# EAGLE schematic untitled (EAGLE 7.6.0)
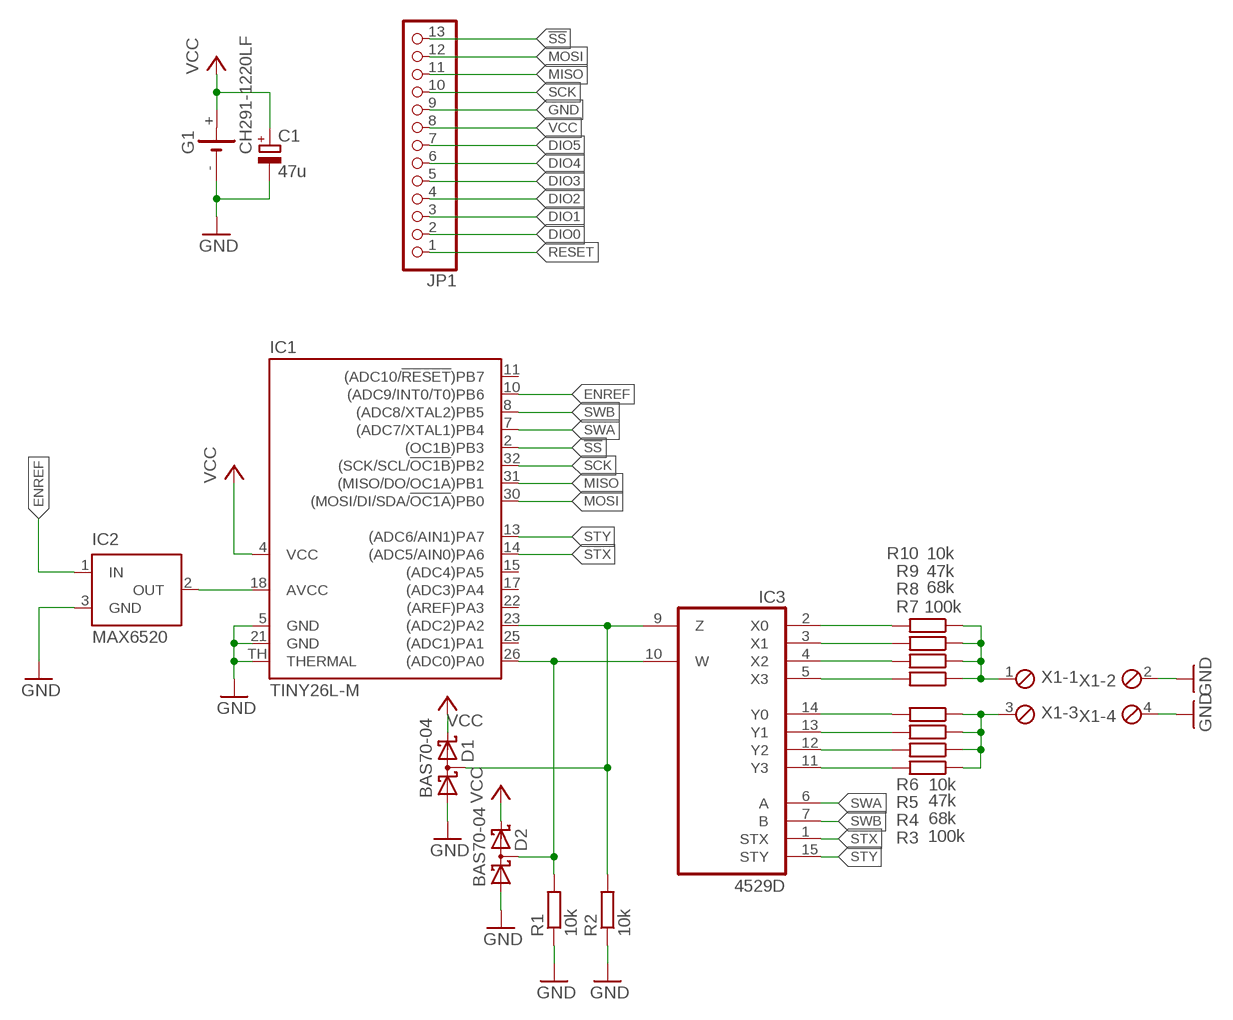
[diagram p0: schematic, sheet 1]

## Parts
C1  47u  CPOL-EUSANYO_SMD_E7  [SANYO-OSCON_SMD_E7]
D1  BAS70-04  [SOT23]
D2  BAS70-04  [SOT23]
G1  CH291-1220LF  [CH291-1220LF]
IC1  TINY26L-M  [MLF32-TH]
IC2  MAX6520  [SOT23]
IC3  4529D  [SO16]
JP1  PINHD-1X13  [1X13]
R1  10k  R-EU_R1206  [R1206]
R2  10k  R-EU_R1206  [R1206]
R3  100k  R-EU_R1206  [R1206]
R4  68k  R-EU_R1206  [R1206]
R5  47k  R-EU_R1206  [R1206]
R6  10k  R-EU_R1206  [R1206]
R7  100k  R-EU_R1206  [R1206]
R8  68k  R-EU_R1206  [R1206]
R9  47k  R-EU_R1206  [R1206]
R10  10k  R-EU_R1206  [R1206]
X1  MPT4  [4POL254]

## Nets
!SS: IC1.2((OC1B)PB3) JP1.13
DIO0: JP1.2
DIO1: JP1.3
DIO2: JP1.4
DIO3: JP1.5
DIO4: JP1.6
DIO5: JP1.7
ENREF: IC1.10((ADC9/INT0/T0)PB6) IC2.1(IN)
GND: C1.- D1.1(A1) D2.1(A1) G1.- IC1.5(GND) IC1.21(GND) IC1.TH(THERMAL) IC2.3(GND) JP1.9 R1.1 R2.1 X1.2 X1.4
MISO: IC1.31((MISO/DO/OC1A)PB1) JP1.11
MOSI: IC1.30((MOSI/DI/SDA/!OC1A!)PB0) JP1.12
N$1: D2.3(C1A2) IC1.26((ADC0)PA0) IC3.10(W) R1.2
N$2: IC1.18(AVCC) IC2.2(OUT)
N$3: D1.3(C1A2) IC1.23((ADC2)PA2) IC3.9(Z) R2.2
N$4: R6.2
N$5: R5.2
N$6: R4.2
N$7: R3.2
N$8: R3.1 R4.1 R5.1 R6.1 X1.3
N$9: IC3.5(X3) R7.2
N$10: IC3.4(X2) R8.2
N$11: IC3.3(X1) R9.2
N$12: IC3.2(X0) R10.2
N$13: R7.1 R8.1 R9.1 R10.1 X1.1
RESET: JP1.1
SCK: IC1.32((SCK/SCL/!OC1B!)PB2) JP1.10
STX: IC1.14((ADC5/AIN0)PA6) IC3.1(STX)
STY: IC1.13((ADC6/AIN1)PA7) IC3.15(STY)
SWA: IC1.7((ADC7/XTAL1)PB4) IC3.6(A)
SWB: IC1.8((ADC8/XTAL2)PB5) IC3.7(B)
VCC: C1.+ D1.2(C2) D2.2(C2) G1.+ IC1.4(VCC) JP1.8
Unconnected: IC1.11((ADC10/!RESET!)PB7) IC1.15((ADC4)PA5) IC1.17((ADC3)PA4) IC1.22((AREF)PA3) IC1.25((ADC1)PA1) IC3.11(Y3) IC3.12(Y2) IC3.13(Y1) IC3.14(Y0)

## Power pins joined to a net without a drawn wire
VDD: IC3.16(VDD)
VSS: IC3.8(VSS)

## Library data of the parts
C1 = rcl:CPOL-EU: POLARIZED CAPACITOR, European symbol
D1 D2 = diode:BAS70-04: Silicon Schottky Diodes General-purpose diode for high-speed switching
G1 = battery:CH291-1220LF: Battery Holder, SMT, 12mm multicomp PART NO. CH291-1220LF Source: Data sheet <http://www.farnell.com/datasheets/1505860.pdf>
IC1 = atmel:TINY26*-M: 8-bit AVR Microcontroller with 2K Bytes Flash Source: http://www.atmel.com .. doc1477.pdf; OC_FARNELL: unknown; OC_NEWARK: unknown
IC2 = maxim:MAX6520: 1.2V Voltage Reference 50ppm/°C, SOT23, 3-Terminal Source: Data sheet <http://datasheets.maxim-ic.com/en/ds/MAX6520.pdf>; MF: MAXIM; MPN: MAX6520EUR-T; OC_FARNELL: unknown; OC_NEWARK: 02J4586
IC3 = 45xx:4529: Dual 4-channel analog DATA SELECTOR
JP1 = pinhead:PINHD-1X13: PIN HEADER
R1-R10 = rcl:R-EU_: RESISTOR, European symbol
X1 = con-phoenix-254:MPT4: PHOENIX CONNECTOR; OC_FARNELL: unknown; OC_NEWARK: unknown